# EAGLE design AC_voltage_read (EAGLE 9.3.0)
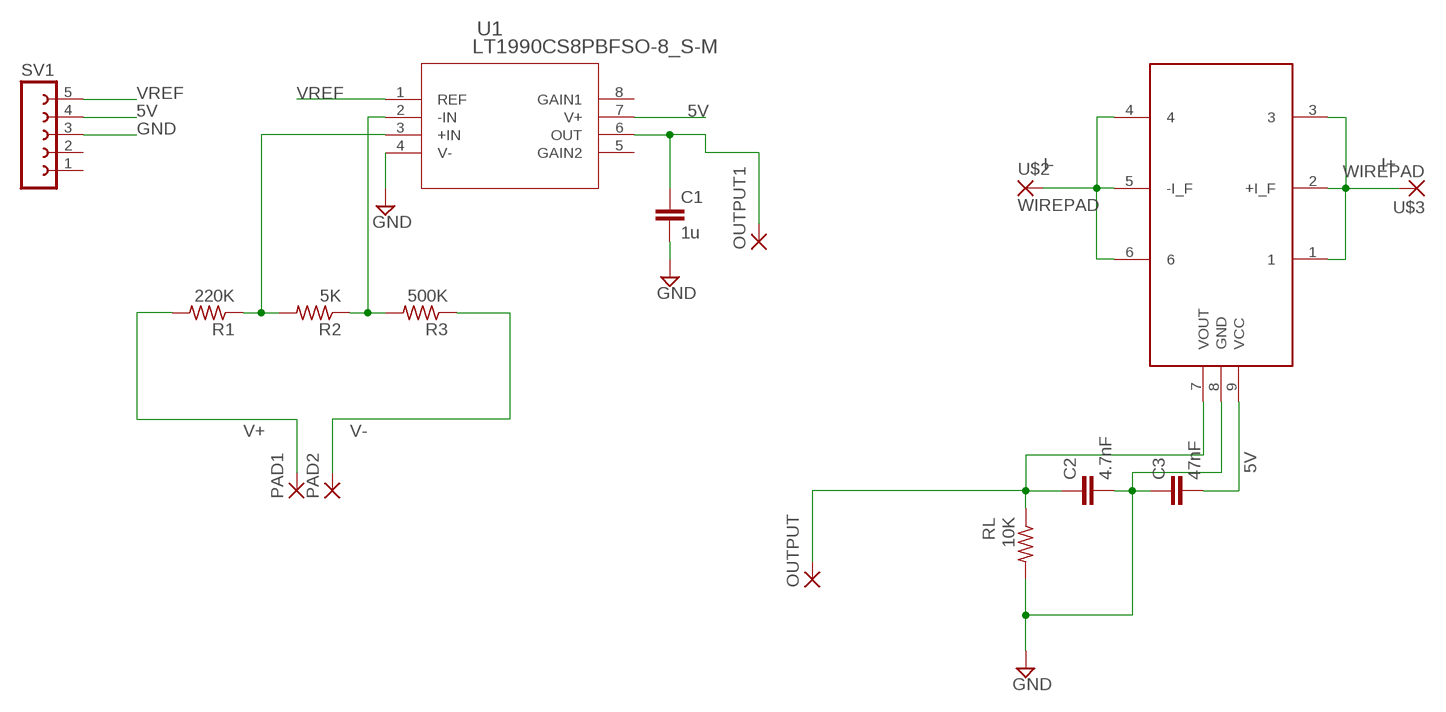
[diagram p0: schematic, sheet 1]

## Parts
C1  1u  C-EU075-032X103  [C075-032X103]
C2  4.7nF  C-EU050-045X075  [C050-045X075]
C3  47nF  C-EU050-045X075  [C050-045X075]
OUTPUT  WIREPAD3,17/1,2  [3,17/1,2]
OUTPUT1  WIREPAD3,17/1,2  [3,17/1,2]
PAD1  3,81/1,1  [3,81/1,1]
PAD2  3,81/1,1  [3,81/1,1]
R1  220K  R-US_0207/12  [0207/12]
R2  5K  R-US_0207/12  [0207/12]
R3  500K  R-US_0207/12  [0207/12]
RL  10K  R-US_0207/12  [0207/12]
SV1  FE05-1  [FE05-1]
U1  LT1990CS8PBFSO-8_S-M  [SO-8_S-M]
U$1  S22P015S05  [S22FOOTPRINT]
U$2  WIREPAD  [WIREPAD]
U$3  WIREPAD  [WIREPAD]

## Nets
5V: C3.2 SV1.4 U1.7(V+) U$1.9(VCC)
GND: C1.2 C2.2 C3.1 RL.2 SV1.3 U1.4(V-) U$1.8(GND)
I+: U$1.1 U$1.2(+I_F) U$1.3 U$3.P$1(P)
I-: U$1.4 U$1.5(-I_F) U$1.6 U$2.P$1(P)
N$1: R2.1 R3.2 U1.2(-IN)
N$2: C1.1 OUTPUT1.1(P) U1.6(OUT)
N$4: C2.1 OUTPUT.1(P) RL.1 U$1.7(VOUT)
N$6: R1.1 R2.2 U1.3(+IN)
V+: PAD1.1(P) R1.2
V-: PAD2.1(P) R3.1
VREF: SV1.5 U1.1(REF)
Unconnected: SV1.1 SV1.2 U1.5(GAIN2) U1.8(GAIN1)

## Library data of the parts
C1-C3 = rcl:C-EU: CAPACITOR, European symbol; SPICEPREFIX: C
OUTPUT OUTPUT1 = wirepad:WIREPAD: Wire PAD connect wire on PCB
PAD1 PAD2 = wirepad:3,81/1,1: THROUGH-HOLE PAD
R1-R3 RL = rcl:R-US_: RESISTOR, American symbol; SPICEPREFIX: R
SV1 = con-lsta:FE05-1: FEMALE HEADER; OC_FARNELL: unknown; OC_NEWARK: unknown
U1 = SamacSys_Parts:LT1990CS8PBF; MANUFACTURER_PART_NUMBER: lt1990cs8#pbf; VENDOR: Linear Technology
U$1 = SamacSys_Parts:S22P015S05
U$2 U$3 = feedback_subsystem_components:WIREPAD

## Board
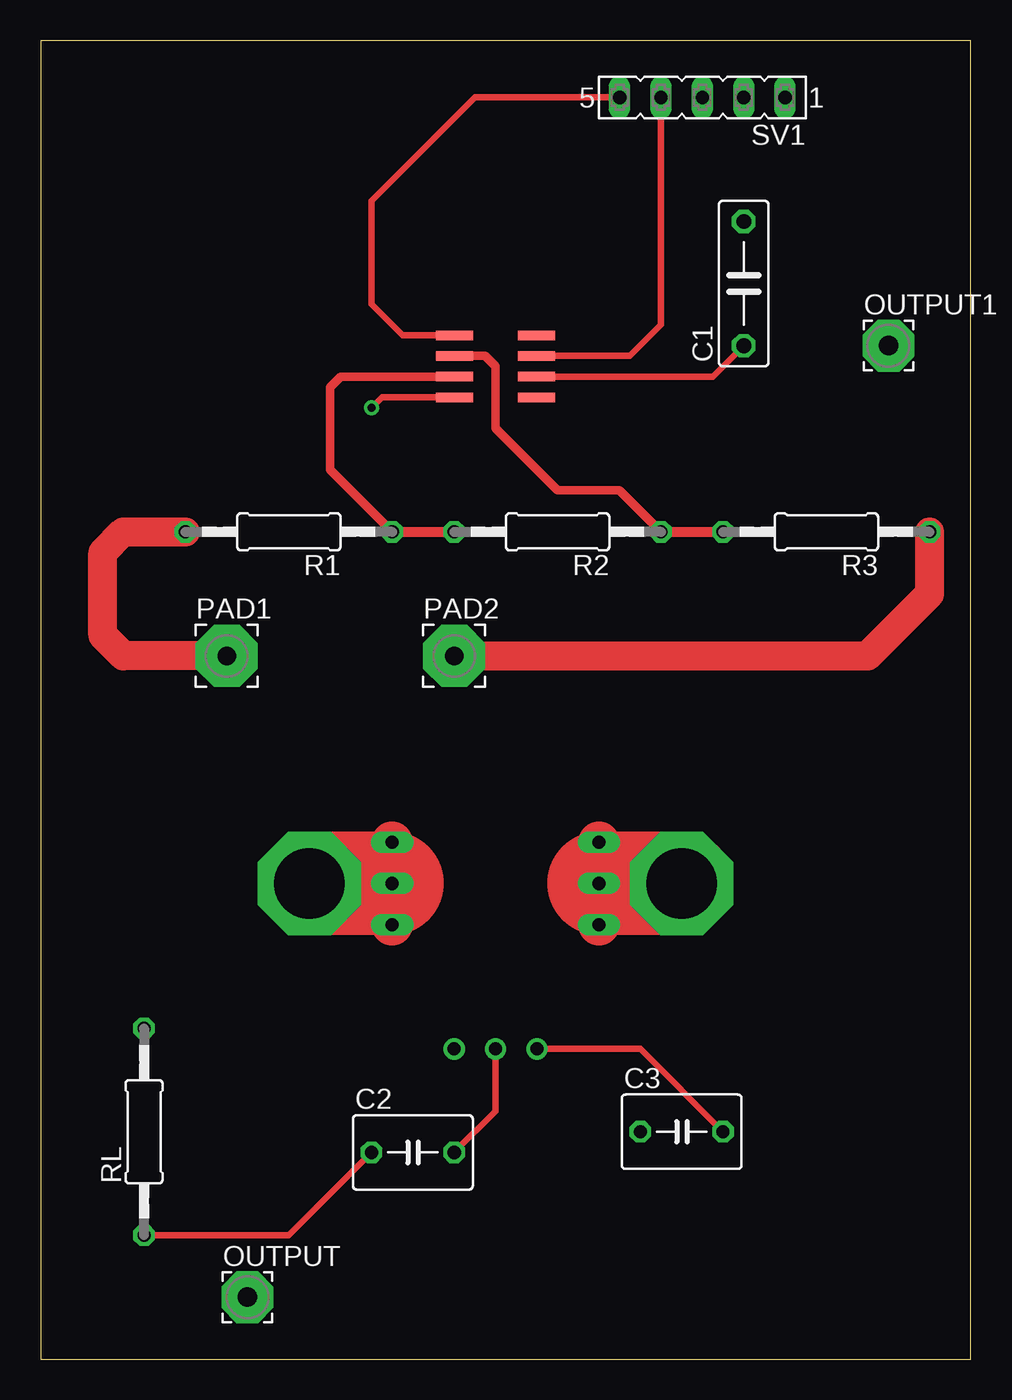
[diagram p1: board, top side]
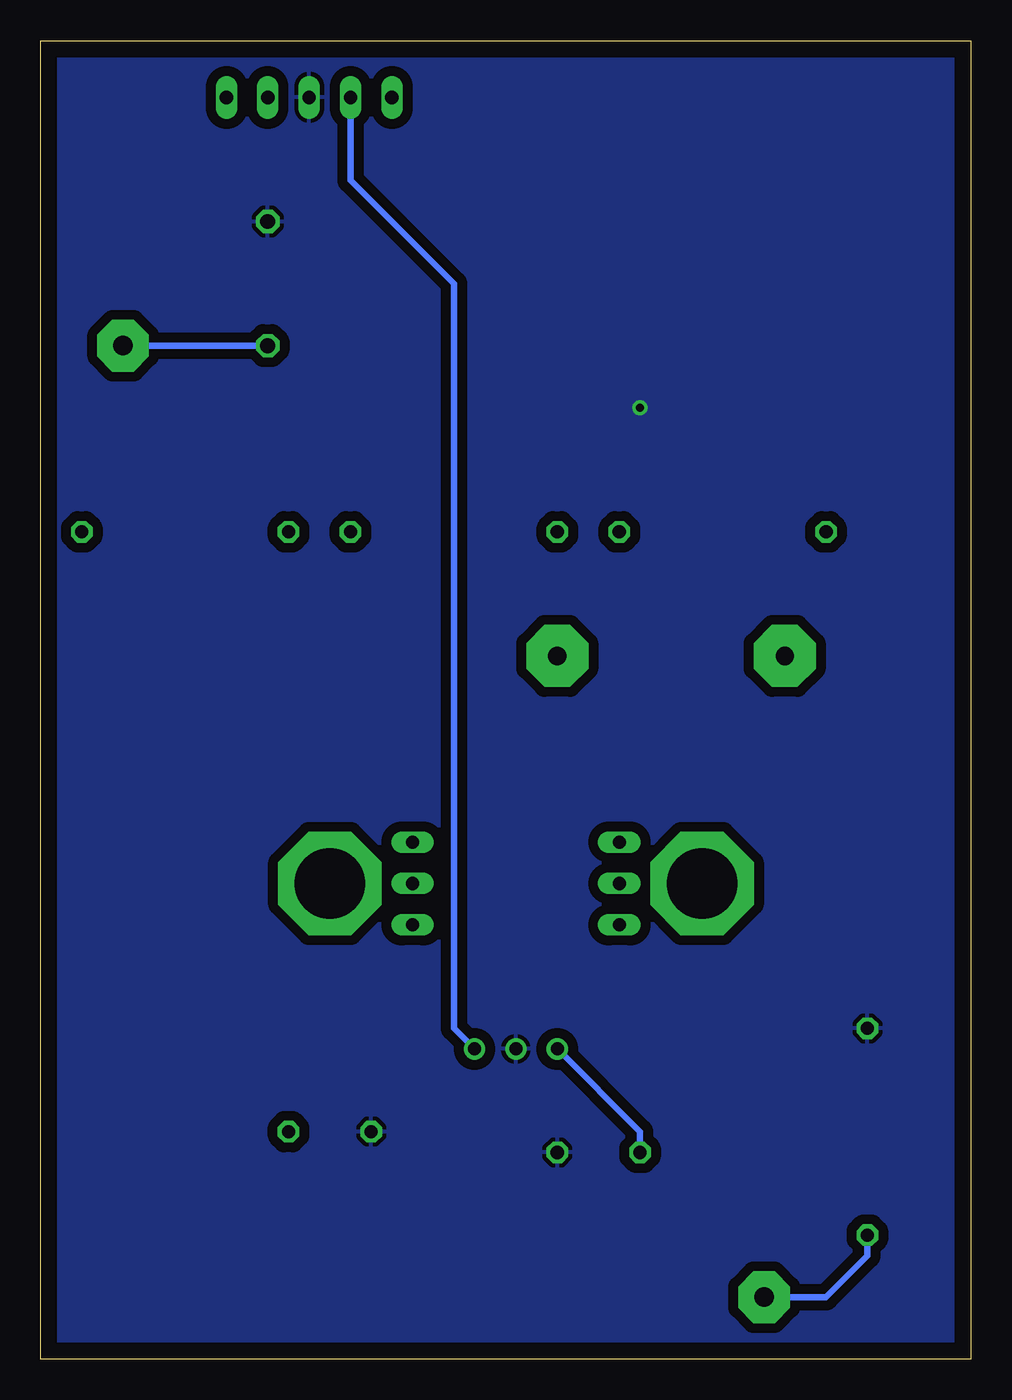
[diagram p2: board, bottom side, seen from below]

Size 57.13 x 80.95 mm. Coordinates in mm from the lower left corner, seen from the top.
Outline: 0,0 57.13,0 57.13,80.95 0,80.95 0,0
Copper layers (1*16): Top 0.035mm / dielectric 1.5mm / Bottom 0.035mm
Design rules "default": minimum track width 6mil, minimum drill 0.35mm, track to track 6mil, track to pad 6mil, pad to pad 6mil, via to via 6mil, smd to smd 6mil, copper to edge 40mil, drill to drill 6mil, minimum pad ring 10mil, minimum via ring 8mil, stop-mask expansion 4mil, vias tented up to drill 0mil, thermal gap 10mil

### Footprints (pad centres in the part's own frame; a part is rotated, then mirrored left to right if it is on the bottom)
C075-032X103 = drill 0.914 octagon: 1 -3.81,0; 2 3.81,0
C050-045X075 = drill 0.813 octagon: 1 -2.54,0; 2 2.54,0
3,17/1,2 = drill 1.194 pad 3.175 octagon: 1 0,0
3,81/1,1 = drill 1.118 pad 3.81 octagon: 1 0,0
0207/12 = drill 0.813 octagon: 1 -6.35,0; 2 6.35,0
FE05-1 = drill 0.813 long: 1 -5.08,0; 2 -2.54,0; 3 0,0; 4 2.54,0; 5 5.08,0
SO-8_S-M = smd 2.286 x 0.584: 1 -2.515,1.905; 2 -2.515,0.635; 3 -2.515,-0.635; 4 -2.515,-1.905; 5 2.515,-1.905; 6 2.515,-0.635; 7 2.515,0.635; 8 2.515,1.905
S22FOOTPRINT = drill 0.8 long: 1 0,-5.08; 2 0,-2.54; 3 0,0; 4 -12.7,0; 5 -12.7,-2.54; 6 -12.7,-5.08 | drill 0.8: 7 -8.89,-12.7; 8 -6.35,-12.7; 9 -3.81,-12.7
WIREPAD = drill 4.318 pad 6.35 octagon: P$1 0,0

### Placement (x,y rotation side)
C1  43.18,66.04 90 top
C2  22.86,12.7 0 top
C3  39.37,13.97 0 top
OUTPUT  12.7,3.81 0 top
OUTPUT1  52.07,62.23 0 top
PAD1  11.43,43.18 0 top
PAD2  25.4,43.18 0 top
R1  15.24,50.8 180 top
R2  31.75,50.8 180 top
R3  48.26,50.8 180 top
RL  6.35,13.97 90 top
SV1  40.64,77.47 180 top
U1  27.94,60.96 0 top
U$1  34.29,31.75 0 top
U$2  16.51,29.21 0 top
U$3  39.37,29.21 0 top

### Tracks (layer width: path | path; a pad name or v marks a point on that pad's centre or on a via)
5V
  Top 0.406: U1.7 36.2,61.59 38.1,63.5 SV1.4 | C3.2 36.83,19.05 U$1.9
  Bottom 0.406: U$1.9 31.75,20.32 31.75,66.04 38.1,72.39 SV1.4
GND  (via drill 0.5)
  Top 0.406: U1.4 20.96,59.05 v20.32,58.42 | U$1.8 27.94,15.24 C2.2
  pour Bottom (isolate 0.61): -5.08,83.82 60.96,83.82 60.96,-3.81 -5.08,-3.81
I+
  Top 2.54: U$1.3 U$1.2 U$1.1
  Top 6.35: U$1.2 U$3.P$1
I-
  Top 2.54: U$1.4 U$1.5 U$1.6
  Top 6.35: U$1.5 U$2.P$1
N$1
  Top 0.508: U1.2 27.3,61.59 27.94,60.96 27.94,57.15 31.75,53.34 35.56,53.34 R2.1
  Top 0.61: R2.1 R3.2
N$2
  Top 0.406: U1.6 41.27,60.32 C1.1
  Bottom 0.406: C1.1 OUTPUT1.1
N$4
  Top 0.406: C2.1 15.24,7.62 RL.1
  Bottom 0.406: OUTPUT.1 8.89,3.81 6.35,6.35 RL.1 | U$1.7 20.32,13.97 C2.1
N$6
  Top 0.508: R1.1 17.78,54.61 17.78,59.69 18.42,60.32 U1.3
  Top 0.61: R1.1 R2.2
V+
  Top 1.778: PAD1.1 5.08,43.18 3.81,44.45 3.81,49.53 5.08,50.8 R1.2
V-
  Top 1.778: PAD2.1 50.8,43.18 54.61,46.99 R3.1
VREF
  Top 0.406: U1.1 22.23,62.86 20.32,64.77 20.32,71.12 26.67,77.47 SV1.5